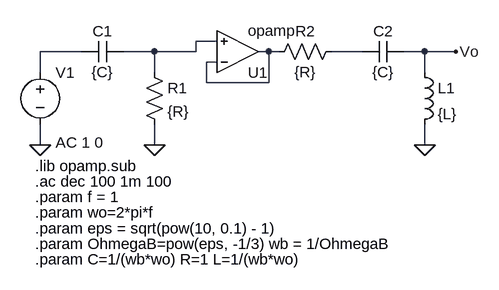
[diagram p0: schematic TS4_3.asc]
TS4_3.asc, the LTspice schematic file:
Version 4
SHEET 1 880 680
WIRE 240 96 208 96
WIRE 32 112 -32 112
WIRE 144 112 96 112
WIRE 208 112 208 96
WIRE 208 112 144 112
WIRE 320 112 304 112
WIRE 336 112 320 112
WIRE 464 112 416 112
WIRE 560 112 528 112
WIRE 608 112 560 112
WIRE 240 128 224 128
WIRE -32 144 -32 112
WIRE 144 144 144 112
WIRE 560 144 560 112
WIRE 224 160 224 128
WIRE 320 160 320 112
WIRE 320 160 224 160
WIRE -32 256 -32 224
WIRE 144 256 144 224
WIRE 560 256 560 224
FLAG -32 256 0
FLAG 144 256 0
FLAG 560 256 0
FLAG 608 112 Vo
SYMBOL cap 96 96 R90
WINDOW 0 0 32 VBottom 2
WINDOW 3 32 32 VTop 2
SYMATTR InstName C1
SYMATTR Value {C}
SYMBOL res 128 128 R0
SYMATTR InstName R1
SYMATTR Value {R}
SYMBOL OpAmps\\opamp 272 176 M180
SYMATTR InstName U1
SYMBOL res 432 96 R90
WINDOW 0 0 56 VBottom 2
WINDOW 3 32 56 VTop 2
SYMATTR InstName R2
SYMATTR Value {R}
SYMBOL cap 528 96 R90
WINDOW 0 0 32 VBottom 2
WINDOW 3 32 32 VTop 2
SYMATTR InstName C2
SYMATTR Value {C}
SYMBOL ind 544 128 R0
SYMATTR InstName L1
SYMATTR Value {L}
SYMBOL voltage -32 128 R0
WINDOW 123 24 124 Left 2
WINDOW 39 0 0 Left 0
SYMATTR InstName V1
SYMATTR Value ""
SYMATTR Value2 AC 1 0
TEXT -40 360 Left 2 !.param wo=2*pi*f
TEXT -40 288 Left 2 !.lib opamp.sub
TEXT -40 336 Left 2 !.param f = 1
TEXT -40 432 Left 2 !.param C=1/(wb*wo) R=1 L=1/(wb*wo)
TEXT -40 312 Left 2 !.ac dec 100 1m 100
TEXT -40 384 Left 2 !.param eps = sqrt(pow(10, 0.1) - 1)
TEXT -40 408 Left 2 !.param OhmegaB=pow(eps, -1/3) wb = 1/OhmegaB

The netlist it stands for:
* TS4_3.asc
C1 N001 N002 {C}
R1 N001 0 {R}
XU1 N003 N001 N003 opamp Aol=100K GBW=10Meg  ; pins invin noninvin out
R2 N004 N003 {R}
C2 Vo N004 {C}
L1 Vo 0 {L}
V1 N002 0 AC 1 0
.param wo=2*pi*f
.lib opamp.sub
.param f = 1
.param C=1/(wb*wo) R=1 L=1/(wb*wo)
.ac dec 100 1m 100
.param eps = sqrt(pow(10, 0.1) - 1)
.param OhmegaB=pow(eps, -1/3) wb = 1/OhmegaB
.backanno
.end